# Altium schematic sheet 8) Power Supply,Config.SchDoc
size 420 x 297 mm
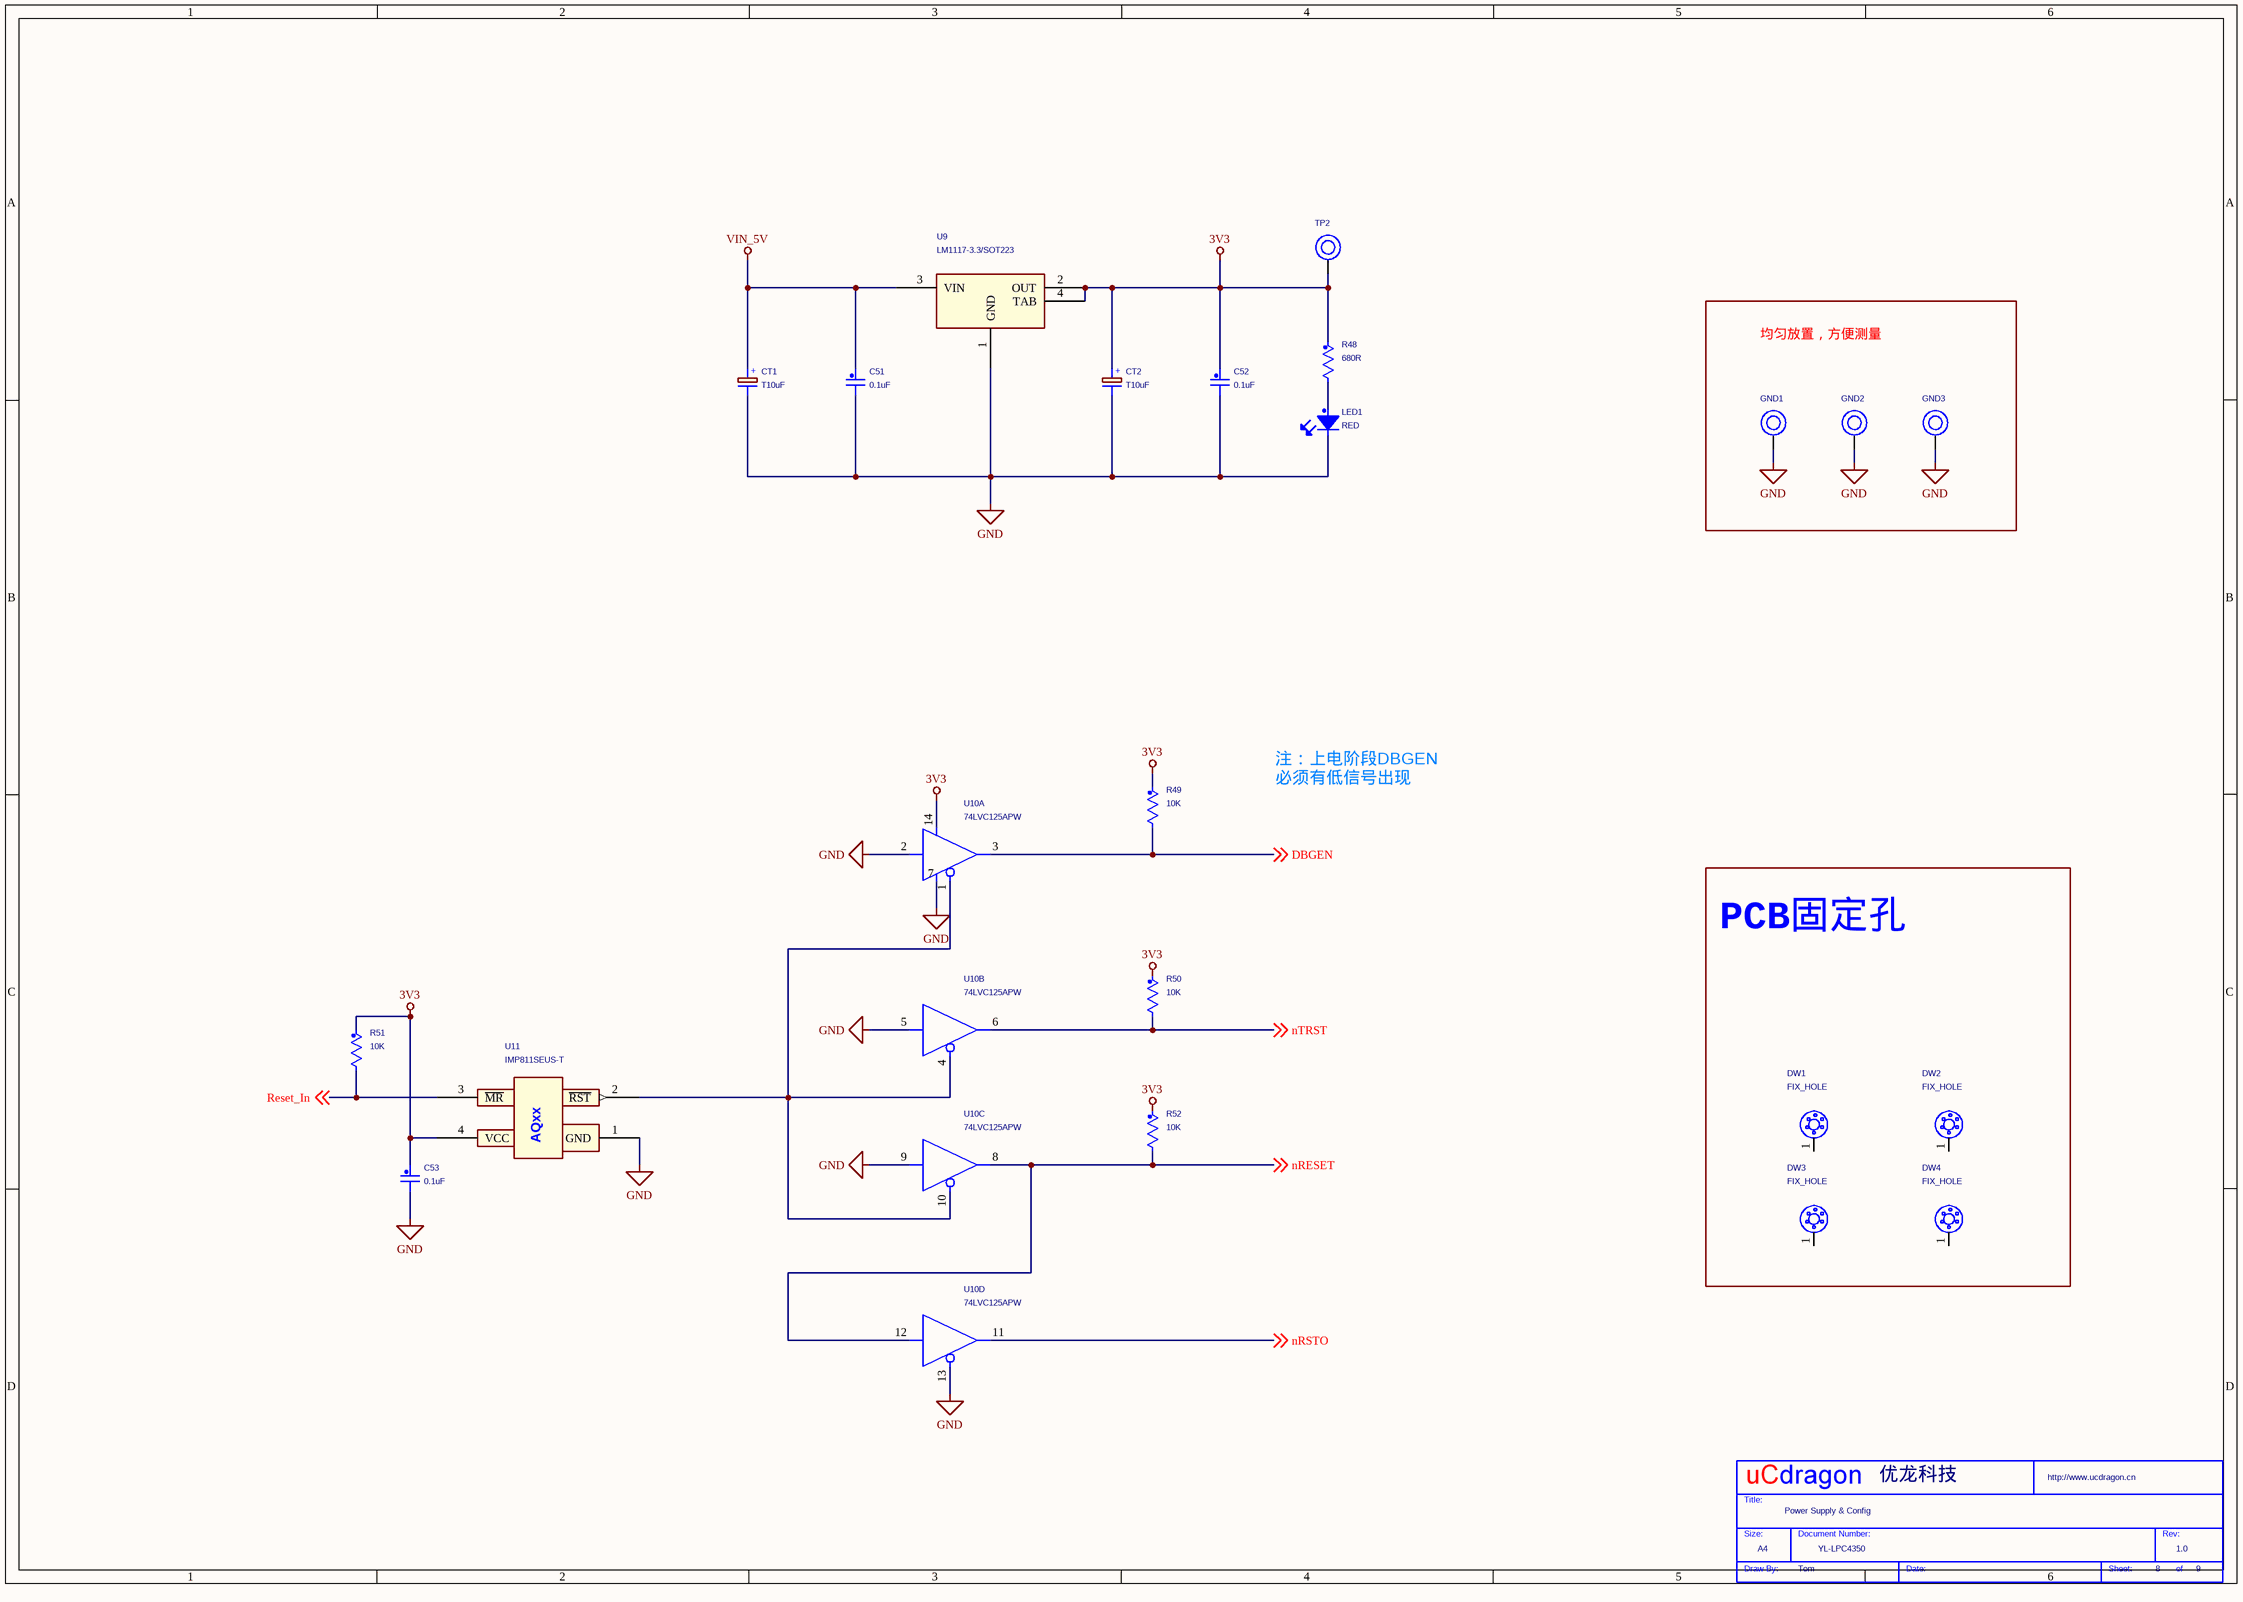
[diagram p0: 8) Power Supply,Config.SchDoc]

## Parts
*  Company: 优龙科技  Drawing: Tom  Doc: YL-LPC4350  RevCode: 1.0  Title: Power Supply & Config  Page Size: A4  Page Number: 8  Page Count: 9  (hidden comment: My Title 0)  (graphical)
C51  0.1uF  [CAP0805]
C52  0.1uF  [CAP0805]
C53  0.1uF  [CAP0805]
CT1  T10uF  [TAN-A]
CT2  T10uF  [TAN-A]
DW1  FIX_HOLE  [FULCRUM2]
DW2  FIX_HOLE  [FULCRUM2]
DW3  FIX_HOLE  [FULCRUM2]
DW4  FIX_HOLE  [FULCRUM2]
GND1  GND  [XP-TP-H0.8MM]  (value not drawn)
GND2  GND  [XP-TP-H0.8MM]  (value not drawn)
GND3  GND  [XP-TP-H0.8MM]  (value not drawn)
LED1  RED  [LED0603]
R48  680R  [R0603]
R49  10K  [R0603]
R50  10K  [R0603]
R51  10K  [R0603]
R52  10K  [R0603]
TP2  3.3V  [XP-TP-H0.8MM]  (value not drawn)
U9  LM1117-3.3/SOT223  [XP-SOT223-3]
U10  74LVC125APW  [74LVC125APW_TSSOP14]  (parts A,B,C,D of 4)
U11  IMP811SEUS-T  [SOT143A]

## Blocks framed on the sheet
均匀放置，方便测量: GND1-GND3
PCB固定孔: DW1-DW4

## Nets
3V3: C52.1 C53.1 CT2.1 R48.1 R49.1 R50.1 R51.1 R52.1 TP2.1 U9.2(OUT) U9.4(TAB) U10.14(VCC) U11.4(VCC)
GND: C51.2 C52.2 C53.2 CT1.2 CT2.2 GND1.1 GND2.1 GND3.1 LED1.2 U9.1(GND) U10.2(A) U10.5(A) U10.7(GND) U10.9(A) U10.13(OE) U11.1(GND)
VIN_5V: C51.1 CT1.1 U9.3(VIN)
DBGEN: R49.2 U10.3(Y) ; off-sheet DBGEN
nRESET: R52.2 U10.8(Y) U10.12(A) ; off-sheet nRESET
nRSTO: U10.11(Y) ; off-sheet nRSTO
nTRST: R50.2 U10.6(Y) ; off-sheet nTRST
Reset_In: R51.2 U11.3(~{MR}) ; off-sheet Reset_In
NetLED1_1: LED1.1 R48.2
NetU10_1: U10.1(OE) U10.4(OE) U10.10(OE) U11.2(~{RST})

Not connected (* = marked no-connect by the designer): DW1 1; DW2 1; DW3 1; DW4 1

## Notes on the sheet
- 注：上电阶段DBGEN
  必须有低信号出现
- (in symbol CAP PN) +
- (in symbol IMP811SEUS-T) AQxx
- (in symbol My Title 0) Title:; Size:; Document Number:; Rev:; Draw By:; Date:; Sheet:; of

## Library data of the parts
C51-C53 = C_Generic: Toler.: 10%; P/N #1: C0603C104K4RAC; Voltage: 16V; Mfg #1: KEMET; Dielectric: X7R
CT1 CT2 = CAP PN: SDTSourceLibName: C:\WINDOWS\TEMP\SNDS.LIB
GND1-GND3 TP2 = TestPoint-HOLE
LED1 = LED Marking Pin 1
R48-R52 = R_Generic_Dup2
U9 = LM1117 SOT223
U10 = 74HC125
* = My Title 0: WebSite: http://www.ucdragon.cn; Page Create Date: May 29, 2006